# Altium project Sunstrip LED.PrjPcb
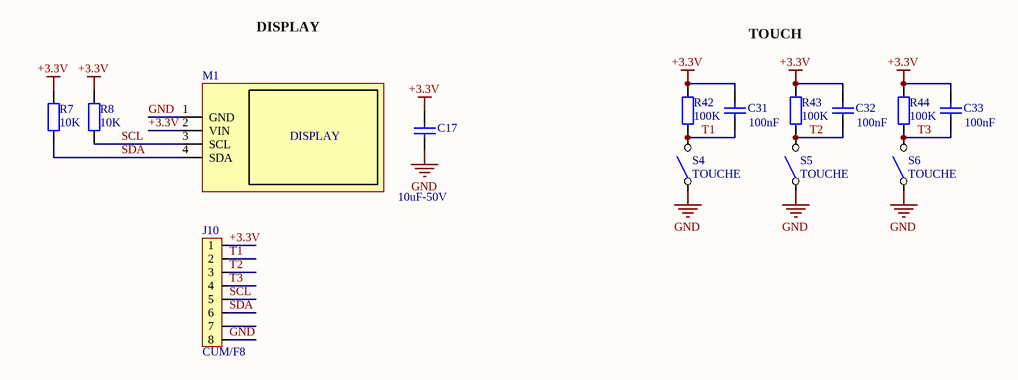
[diagram p0: IHM.SchDoc]
5 sheets, 89 parts. Net scope: global (net labels, ports and power ports of the same name join across sheets).
Board file: PCB.PcbDoc
Sheets:
  IHM.SchDoc
  MCU.SchDoc
  Mechanical.SchDoc
  Outputs.SchDoc
  Power_Supply.SchDoc

## Sheet IHM.SchDoc: Carte Découpe DMX
size A4

### Parts
C17  10uF-50V  [C1206]
C31  100nF  [C0603]
C32  100nF  [C0603]
C33  100nF  [C0603]
J10  CUM/F8  [BARF-2X4]
M1  (no value)  [I2C_OLED_0.96]
R7  10K  [R0603]
R8  10K  [R0603]
R42  100K  [R0603]
R43  100K  [R0603]
R44  100K  [R0603]
S4  TOUCHE  [INT-CMS1]
S5  TOUCHE  [INT-CMS1]
S6  TOUCHE  [INT-CMS1]

### Nets
+3.3V: C17.2 C31.2 C32.2 C33.2 J10.1 M1.2(VIN) R7.2 R8.2 R42.2 R43.2 R44.2
GND: C17.1 J10.8 M1.1(GND) S4.1 S5.1 S6.1
SCL: J10.5 M1.3(SCL) R8.1
SDA: J10.6 M1.4(SDA) R7.1
T1: C31.1 J10.2 R42.1 S4.4
T2: C32.1 J10.3 R43.1 S5.4
T3: C33.1 J10.4 R44.1 S6.4

Not connected (* = marked no-connect by the designer): J10 7

### Notes on the sheet
- DISPLAY
- TOUCH
- Title
- Size:
- Date:
- A4
- Number:
- Time:
- Revision:
- Sheet
- of
- File:
- (in symbol I2C-OLED-0.96) DISPLAY

### Library data of the parts
C17 C31-C33 = Cap: Capacitor
  C17: Value: 10uF-50V
  C31-C33: Value: 100nF
J10 = CUM/F8: connecteur 8 points
M1 = I2C-OLED-0.96: I2C OLED 0.96"
R7 R8 R42-R44 = Res: Thin Metal Film Resistor
  R7 R8: Value: 10K
  R42-R44: Value: 100K

## Sheet MCU.SchDoc: Carte Découpe DMX
size A4
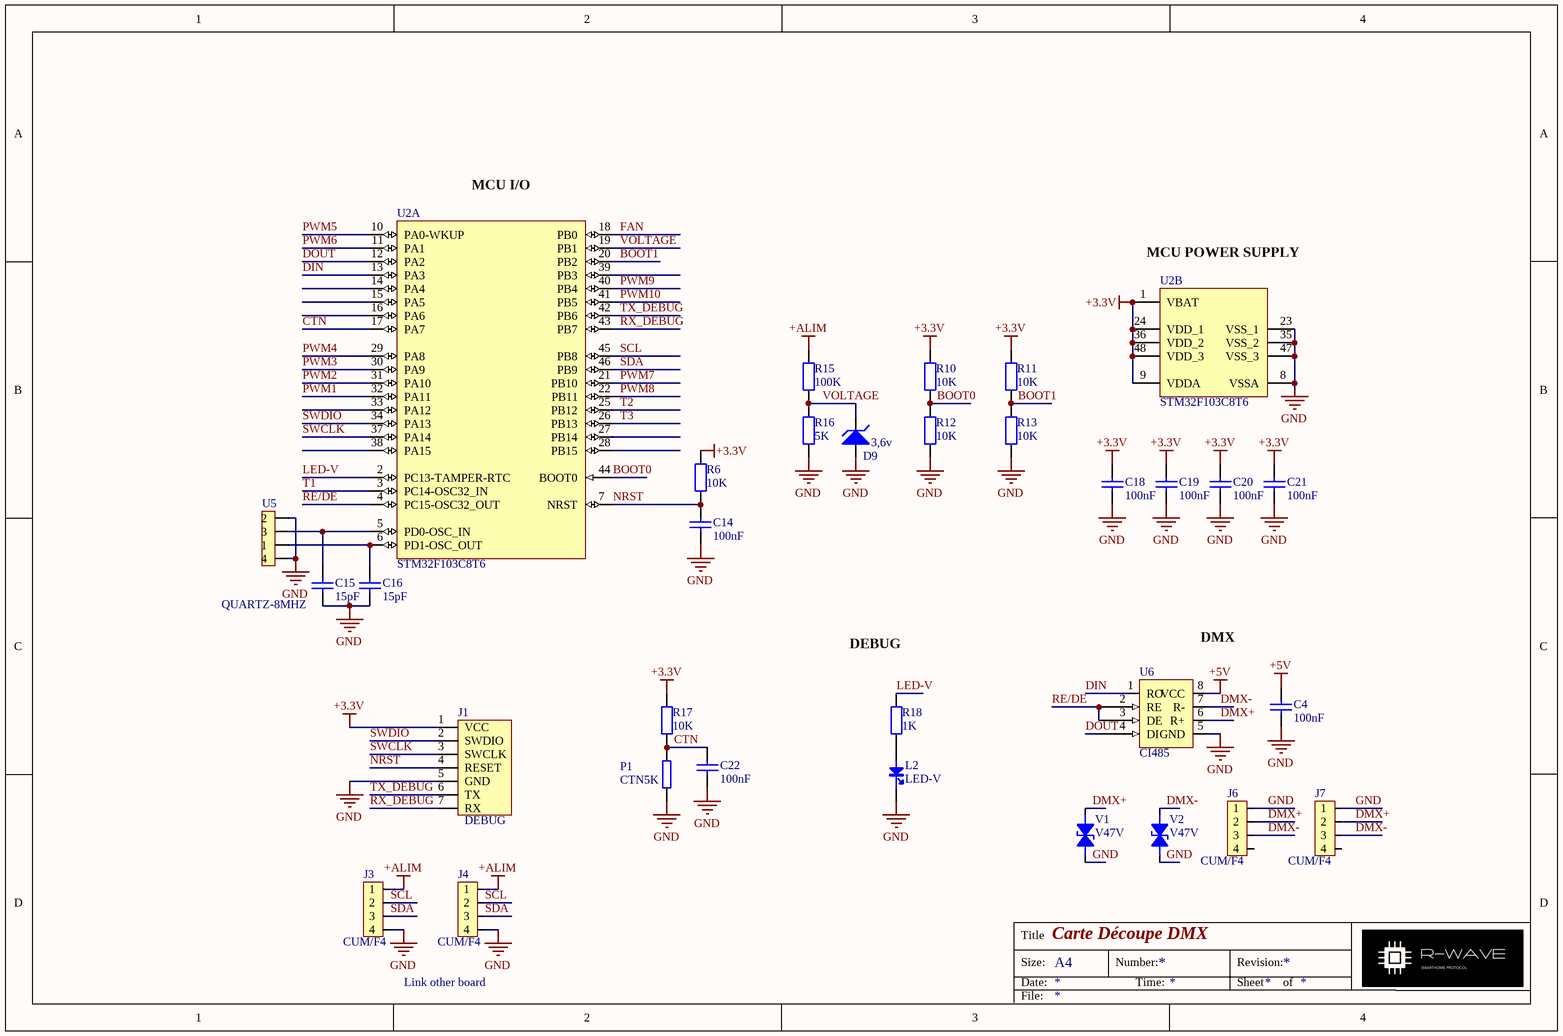
[diagram p1: MCU.SchDoc]

### Parts
C4  100nF  [C0603]
C14  100nF  [C0603]
C15  15pF  [C0603]
C16  15pF  [C0603]
C18  100nF  [C0603]
C19  100nF  [C0603]
C20  100nF  [C0603]
C21  100nF  [C0603]
C22  100nF  [C0603]
D9  3,6v  [SOD123]
J1  (no value)  [CON_PROG]
J3  CUM/F4  [CNT4F5]
J4  CUM/F4  [CNT4F5]
J6  CUM/F4  [CNT4S]
J7  CUM/F4  [CNT4S]
L2  LED-V  [LED-V1A]
P1  CTN5K  [DIV015]
R6  10K  [R0603]
R10  10K  [R0603]
R11  10K  [R0603]
R12  10K  [R0603]
R13  10K  [R0603]
R15  100K  [R0603]
R16  5K  [R0603]
R17  10K  [R0603]
R18  1K  [R0603]
U2  STM32F103C8T6  [TQFP-48]  (parts A,B of 2)
U5  QUARTZ-8MHZ  [QUA8G]
U6  CI485  [CIA485A]
V1  V47V  [VAR47A]
V2  V47V  [VAR47A]

### Nets
+3.3V: C18.2 C19.2 C20.2 C21.2 J1.1(VCC) R6.2 R10.2 R11.2 R17.2 U2.1(VBAT) U2.9(VDDA) U2.24(VDD_1) U2.36(VDD_2) U2.48(VDD_3)
+5V: C4.2 U6.8(VCC)
+ALIM: J3.1 J4.1 R15.2
GND: C4.1 C14.1 C15.2 C16.1 C18.1 C19.1 C20.1 C21.1 C22.1 D9.1(A) J1.5(GND) J3.4 J4.4 J6.1 J7.1 L2.2 P1.1 R12.1 R13.1 R16.1 U2.8(VSSA) U2.23(VSS_1) U2.35(VSS_2) U2.47(VSS_3) U5.2 U5.4 U6.5(GND) V1.2 V2.2
BOOT0: R10.1 R12.2 U2.44(BOOT0)
BOOT1: R11.1 R13.2 U2.20(PB2)
CTN: C22.2 P1.2 R17.1 U2.17(PA7)
DIN: U2.13(PA3) U6.1(RO)
DMX+: J6.2 J7.2 U6.6(R+) V1.1
DMX-: J6.3 J7.3 U6.7(R-) V2.1
DOUT: U2.12(PA2) U6.4(DI)
FAN: U2.18(PB0)
LED-V: R18.2 U2.2(PC13-TAMPER-RTC)
NRST: C14.2 J1.4(RESET) R6.1 U2.7(NRST)
PWM1: U2.32(PA11)
PWM2: U2.31(PA10)
PWM3: U2.30(PA9)
PWM4: U2.29(PA8)
PWM5: U2.10(PA0-WKUP)
PWM6: U2.11(PA1)
PWM7: U2.21(PB10)
PWM8: U2.22(PB11)
PWM9: U2.40(PB4)
PWM10: U2.41(PB5)
RE/DE: U2.4(PC15-OSC32_OUT) U6.2(RE) U6.3(DE)
RX_DEBUG: J1.7(RX) U2.43(PB7)
SCL: J3.2 J4.2 U2.45(PB8)
SDA: J3.3 J4.3 U2.46(PB9)
SWCLK: J1.3(SWCLK) U2.37(PA14)
SWDIO: J1.2(SWDIO) U2.34(PA13)
T1: U2.3(PC14-OSC32_IN)
T2: U2.25(PB12)
T3: U2.26(PB13)
TX_DEBUG: J1.6(TX) U2.42(PB6)
VOLTAGE: D9.2(K) R15.1 R16.2 U2.19(PB1)
NetC15_1: C15.1 U2.5(PD0-OSC_IN) U5.3
NetC16_2: C16.2 U2.6(PD1-OSC_OUT) U5.1
NetL2_1: L2.1 R18.1

Not connected (* = marked no-connect by the designer): J6 4; J7 4; U2 14(PA4) 15(PA5) 16(PA6) 27(PB14) 28(PB15) 33(PA12) 38(PA15) 39(PB3)

### Notes on the sheet
- (near U2) MCU I/O
- (near U2) MCU POWER SUPPLY
- DEBUG
- (near U6) DMX
- (near J1) DEBUG
- Link other board
- Title
- Size:
- Date:
- A4
- Number:
- Time:
- Revision:
- Sheet
- of
- File:

### Library data of the parts
C4 C14-C16 C18-C22 = Cap: Capacitor
  C4 C14 C18-C22: Value: 100nF
  C15 C16: Value: 15pF
D9 = D Zener: Zener Diode; Value: 3,6v
J1 = CON-PROG: Programming Connector
J3 J4 J6 J7 = CUM/F4: connecteur  4 points
L2 = LED-V: LED  piquer  ou  CMS verte
P1 = CTN5K: Photoresistance
R6 R10-R13 R15-R18 = Res: Thin Metal Film Resistor
  R6 R10-R13 R17: Value: 10K
  R15: Value: 100K
  R16: Value: 5K
  R18: Value: 1K
U2 = STM32F103C8T6: ARM Cortex-M3 32-bit MCU, 64 KB Flash, 20 KB Internal RAM, 37 I/Os, 48-pin LQFP, -40 to 85 degC, Tray; Operating Frequency(F) (Processor speed) (MHz): 72; Supply Voltage(Vcc) min (V): 2; FLASH Size (Prog) (kB): 64; Internal RAM Size (kB): 20; I/Os (High Current): 37; A/D Converter: 2x12-bit (10 Channel); Core: ARM Cortex-M3; ComponentLink2Description: Datasheet; ComponentLink3Description: Package Specification; Mounting Technology: Surface Mount; ComponentLink3URL: http://www.st.com/st-web-ui/static/active/en/resource/technical/document/datasheet/DM00058181.pdf; DatasheetVersion: Rev. 16; ComponentLink1URL: http://www.st.com/web/en/home.html; ComponentLink1Description: Manufacturer URL; PartNumber: STM32F103C8T6; Packing: Tray; PackageVersion: Rev. 6, 06/2013; PackageReference: LQFP48; PackageDescription: 48-Pin Low Profile Quad Flat Package, 7 x 7 mm Body, 0.5 mm Pitch; ComponentLink2URL: http://www.st.com/st-web-ui/static/active/en/resource/technical/document/datasheet/CD00161566.pdf
U5 = QUARTZ-8MHZ: QUARTZ 8 MHZ CMS
U6 = CI485: DRIVER  RS485
V1 V2 = V47V: VARISTANCE 47V BOITIER 1206

## Sheet Mechanical.SchDoc: Carte Découpe DMX
size A4
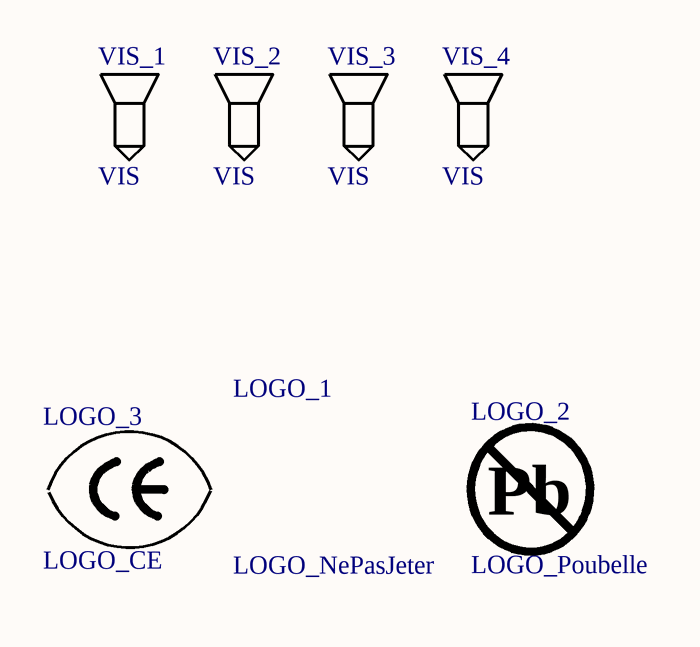
[diagram p2: Mechanical.SchDoc]

### Parts
LOGO_1  LOGO_NePasJeter  [LogoNePasJeter]
LOGO_2  LOGO_Poubelle  [LogoPB]
LOGO_3  LOGO_CE  [LogoCE]
VIS_1  VIS  [HOLE3.5mm]
VIS_2  VIS  [HOLE3.5mm]
VIS_3  VIS  [HOLE3.5mm]
VIS_4  VIS  [HOLE3.5mm]

### Notes on the sheet
- Title
- Size:
- Date:
- A4
- Number:
- Time:
- Revision:
- Sheet
- of
- File:
- (in symbol LOGO_Poubelle) Pb

### Library data of the parts
LOGO_1 = LOGO_NePasJeter: Logo Ne Pas Jeter (sérigraphie)
LOGO_2 = LOGO_Poubelle: Logo poubelle (sérigraphie)
LOGO_3 = LOGO_CE: Logo CE (sérigraphie)

## Sheet Outputs.SchDoc: Carte Découpe DMX
size A4
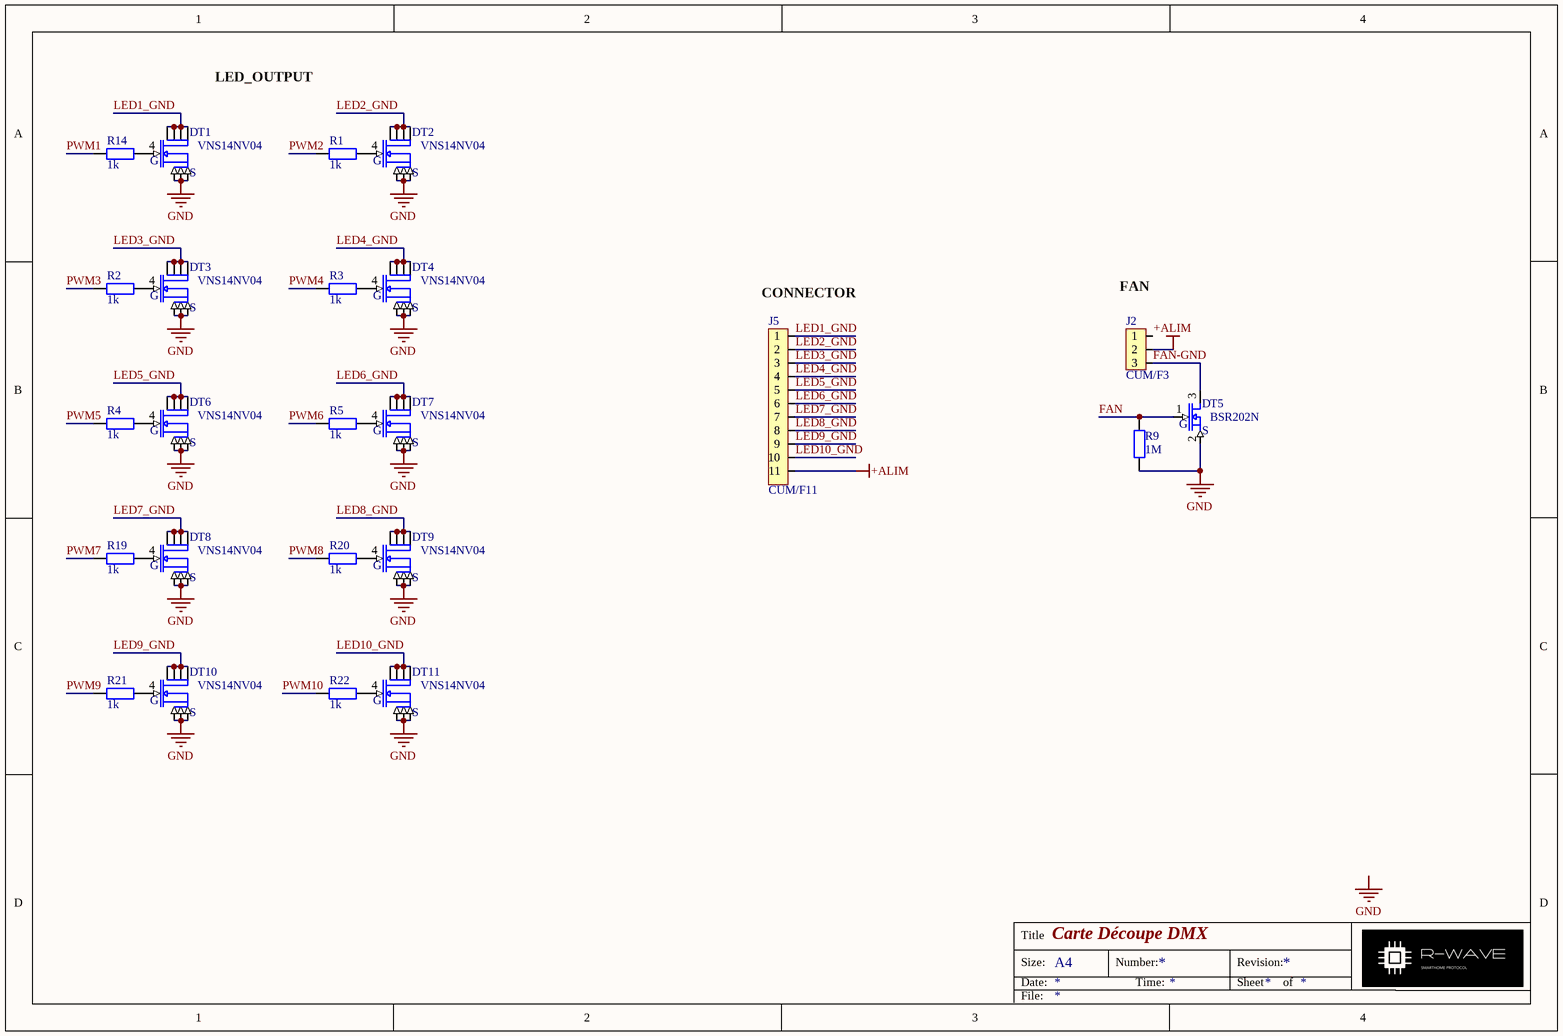
[diagram p3: Outputs.SchDoc]

### Parts
J2  CUM/F3  [HDR1X3]
J5  CUM/F11  [CNT11D]
R1  1k  [R0603]
R2  1k  [R0603]
R3  1k  [R0603]
R4  1k  [R0603]
R5  1k  [R0603]
R9  1M  [R0603]
R14  1k  [R0603]
R19  1k  [R0603]
R20  1k  [R0603]
R21  1k  [R0603]
R22  1k  [R0603]
T1  VNS14NV04  [TRA14NV04]
T2  VNS14NV04  [TRA14NV04]
T3  VNS14NV04  [TRA14NV04]
T4  VNS14NV04  [TRA14NV04]
T5  BSR202N  [TRA202]
T6  VNS14NV04  [TRA14NV04]
T7  VNS14NV04  [TRA14NV04]
T8  VNS14NV04  [TRA14NV04]
T9  VNS14NV04  [TRA14NV04]
T10  VNS14NV04  [TRA14NV04]
T11  VNS14NV04  [TRA14NV04]

### Nets
+ALIM: J2.2 J5.11
GND: R9.1 T1.1 T1.2 T1.3 T2.1 T2.2 T2.3 T3.1 T3.2 T3.3 T4.1 T4.2 T4.3 T5.2(S) T6.1 T6.2 T6.3 T7.1 T7.2 T7.3 T8.1 T8.2 T8.3 T9.1 T9.2 T9.3 T10.1 T10.2 T10.3 T11.1 T11.2 T11.3
FAN: R9.2 T5.1(G)
FAN-GND: J2.3 T5.3(D)
LED1_GND: J5.1 T1.5 T1.6 T1.7 T1.8
LED2_GND: J5.2 T2.5 T2.6 T2.7 T2.8
LED3_GND: J5.3 T3.5 T3.6 T3.7 T3.8
LED4_GND: J5.4 T4.5 T4.6 T4.7 T4.8
LED5_GND: J5.5 T6.5 T6.6 T6.7 T6.8
LED6_GND: J5.6 T7.5 T7.6 T7.7 T7.8
LED7_GND: J5.7 T8.5 T8.6 T8.7 T8.8
LED8_GND: J5.8 T9.5 T9.6 T9.7 T9.8
LED9_GND: J5.9 T10.5 T10.6 T10.7 T10.8
LED10_GND: J5.10 T11.5 T11.6 T11.7 T11.8
PWM1: R14.2
PWM2: R1.2
PWM3: R2.2
PWM4: R3.2
PWM5: R4.2
PWM6: R5.2
PWM7: R19.2
PWM8: R20.2
PWM9: R21.2
PWM10: R22.2
NetR1_1: R1.1 T2.4
NetR2_1: R2.1 T3.4
NetR3_1: R3.1 T4.4
NetR4_1: R4.1 T6.4
NetR5_1: R5.1 T7.4
NetR14_1: R14.1 T1.4
NetR19_1: R19.1 T8.4
NetR20_1: R20.1 T9.4
NetR21_1: R21.1 T10.4
NetR22_1: R22.1 T11.4

Not connected (* = marked no-connect by the designer): J2 1

### Notes on the sheet
- LED_OUTPUT
- (near J5) CONNECTOR
- (near J2) FAN
- Labels drawn without touching a wire or pin: GND
- Title
- Size:
- Date:
- A4
- Number:
- Time:
- Revision:
- Sheet
- of
- File:
- (in symbol VNS14NV04) D; G; S

### Library data of the parts
J2 = CUM/F3: connecteur 3 points
J5 = CUM/F11: connecteur 10 points
R1-R5 R9 R14 R19-R22 = Res: Thin Metal Film Resistor
  R1-R5 R14 R19-R22: Value: 1k
  R9: Value: 1M
T1-T4 T6-T11 = VNS14NV04: TRANSISTOR MOS N
T5 = BSR202N: TRANSISTOR MOS N

## Sheet Power_Supply.SchDoc: Carte Découpe DMX
size A4
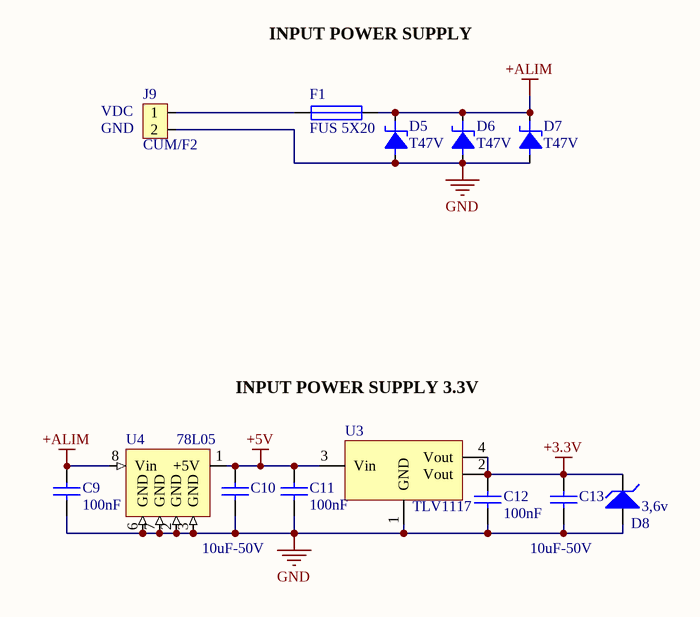
[diagram p4: Power_Supply.SchDoc]

### Parts
C9  100nF  [C0603]
C10  10uF-50V  [C1206]
C11  100nF  [C0603]
C12  100nF  [C0603]
C13  10uF-50V  [C1206]
D5  T47V  [DIO47A]
D6  T47V  [DIO47A]
D7  T47V  [DIO47A]
D8  3,6v  [SOD123]
F1  FUS 5X20  [FUSPO-A1]
J9  CUM/F2  [CNT2H]
U3  TLV1117  [SOT223]
U4  78L05  [REG5VE]

### Nets
+3.3V: C12.1 C13.2 D8.2(K) U3.2(Vout) U3.4(Vout)
+5V: C10.2 C11.1 U3.3(Vin) U4.1(+5V)
+ALIM: C9.1 D5.1 D6.1 D7.1 F1.2 U4.8(Vin)
GND: C9.2 C10.1 C11.2 C12.2 C13.1 D5.2 D6.2 D7.2 D8.1(A) J9.2 U3.1(GND) U4.2(GND) U4.3(GND) U4.6(GND) U4.7(GND)
NetF1_1: F1.1 J9.1

### Notes on the sheet
- INPUT POWER SUPPLY
- (near J9) VDC
- (near J9) GND
- INPUT POWER SUPPLY 3.3V
- Title
- Size:
- Date:
- A4
- Number:
- Time:
- Revision:
- Sheet
- of
- File:

### Library data of the parts
C9-C13 = Cap: Capacitor
  C9 C11 C12: Value: 100nF
  C10 C13: Value: 10uF-50V
D5-D7 = T47V: TRANSIL CMS 47V unidirectionnelle
D8 = D Zener: Zener Diode; Value: 3,6v
F1 = FUS 5X20: FUSIBLE VERRE 5 x 20
J9 = CUM/F2: connecteur  2 points
U3 = TLV1117: LDO regulator 3.3V; Fabricant: Texas; Fournisseur: Farnell; Ref_Fournisseur: 1703385; Prix: 0.75; Ref_Fabricant: TLV1117
U4 = 78L05: E:cms ;C1:faible conso; VD:TO220 debout;

## Nets that join several sheets
+3.3V: IHM (11 pins), MCU (14 pins), Power_Supply (5 pins)
+5V: MCU (C4.2 U6.8), Power_Supply (C10.2 C11.1 U3.3 U4.1)
+ALIM: MCU (J3.1 J4.1 R15.2), Outputs (J2.2 J5.11), Power_Supply (6 pins)
GND: IHM (6 pins), MCU (29 pins), Outputs (32 pins), Power_Supply (15 pins)
FAN: MCU (U2.18), Outputs (R9.2 T5.1)
PWM1: MCU (U2.32), Outputs (R14.2)
PWM2: MCU (U2.31), Outputs (R1.2)
PWM3: MCU (U2.30), Outputs (R2.2)
PWM4: MCU (U2.29), Outputs (R3.2)
PWM5: MCU (U2.10), Outputs (R4.2)
PWM6: MCU (U2.11), Outputs (R5.2)
PWM7: MCU (U2.21), Outputs (R19.2)
PWM8: MCU (U2.22), Outputs (R20.2)
PWM9: MCU (U2.40), Outputs (R21.2)
PWM10: MCU (U2.41), Outputs (R22.2)
SCL: IHM (J10.5 M1.3 R8.1), MCU (J3.2 J4.2 U2.45)
SDA: IHM (J10.6 M1.4 R7.1), MCU (J3.3 J4.3 U2.46)
T1: IHM (C31.1 J10.2 R42.1 S4.4), MCU (U2.3)
T2: IHM (C32.1 J10.3 R43.1 S5.4), MCU (U2.25)
T3: IHM (C33.1 J10.4 R44.1 S6.4), MCU (U2.26)

## Assembly variants
Sunstrip standard: not fitted R10 R11 R13